# EAGLE schematic Core LCD Shield (EAGLE 6.4)
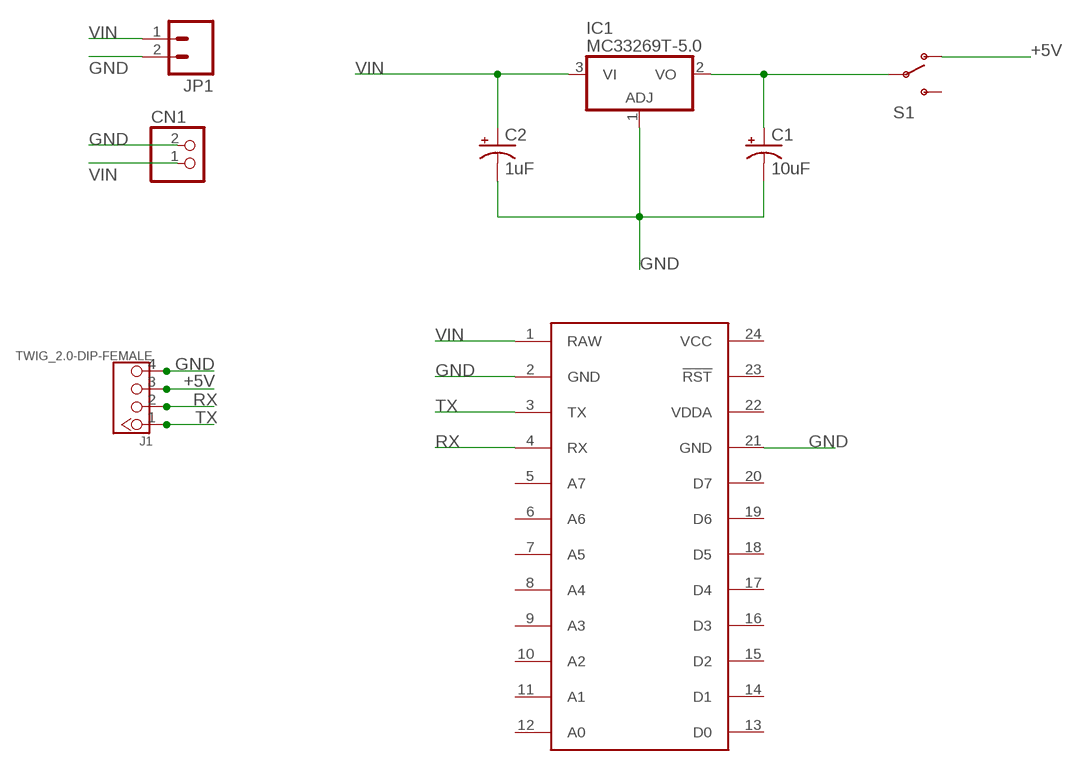
[diagram p0: schematic, sheet 1]

## Parts
C1  10uF  CAP_POLPTH2  [CPOL-RADIAL-10UF-25V]
C2  1uF  CAP_POLPTH2  [CPOL-RADIAL-10UF-25V]
CN1  JST_2PIN-THM  [JST-PH-2-THM]
IC1  MC33269T-5.0  [TO220V]
J1  TWIG_2.0-DIP-FEMALE  [2.0_1X4]
JP1  M02LOCK  [1X02_LOCK]
S1  SWITCH-SPDTPTH  [SWITCH-SPDT]
U$1  SPARK_CORECORE  [SPARK_CORE]

## Nets
+5V: J1.3 S1.1(O)
GND: C1.2(-) C2.2(-) CN1.2 IC1.1(ADJ) J1.4 JP1.2 U$1.2(GND) U$1.21(GND)
N1: C1.1(+) IC1.2(VO) S1.2(P)
RX: J1.2 U$1.4(RX)
TX: J1.1 U$1.3(TX)
VIN: C2.1(+) CN1.1 IC1.3(VI) JP1.1 U$1.1(RAW)
Unconnected: S1.3(S) U$1.5(A7) U$1.6(A6) U$1.7(A5) U$1.8(A4) U$1.9(A3) U$1.10(A2) U$1.11(A1) U$1.12(A0) U$1.13(D0) U$1.14(D1) U$1.15(D2) U$1.16(D3) U$1.17(D4) U$1.18(D5) U$1.19(D6) U$1.20(D7) U$1.23(!RST)

## Power pins joined to a net without a drawn wire
VCC: U$1.24(VCC)
VDDA: U$1.22(VDDA)

## Library data of the parts
C1 C2 = SparkFun-Capacitors:CAP_POL: Capacitor Polarized These are standard SMD and PTH capacitors. Normally 10uF, 47uF, and 100uF in electrolytic and tantalum varieties. Always verify the external diameter of the through hole cap, it varies with capacity, voltage, and manufacturer. The EIA devices should be standard.
CN1 = adafruit:JST_2PIN: JST 2-Pin Connectors of various flavors SMT-RA (S2B-PH-SM4) 4UConnector #17311 SMT (B2B-PH-SM4) THM-RA (S2B-PH) THM (B2B-PH)
IC1 = linear:MC33269?*: Adjustable Output Low Dropout Voltage Regulator 800 mA Source: http://www.onsemi.com/pub/Collateral/MC33269-D.PDF
J1 = Connector:TWIG_2.0-DIP-FEMALE
JP1 = SparkFun-Connectors:M02: Header 2 Standard 2-pin 0.1" header. Use with straight break away headers (SKU : PRT-00116), right angle break away headers (PRT-00553), swiss pins (PRT-00743), machine pins (PRT-00117), and female headers (PRT-00115). Molex polarized connector foot print use with SKU : PRT-08233 with associated crimp pins and housings.
S1 = SparkFun-Electromechanical:SWITCH-SPDT: SPDT Switch Simple slide switch, Spark Fun Electronics SKU : COM-00102 DPDT SMT slide switch, AYZ0202, SWCH-08179
U$1 = Spark:SPARK_CORE

## Net classes
0 default: width 0.152 mm, drill 0.305 mm, clearance 0.152 mm